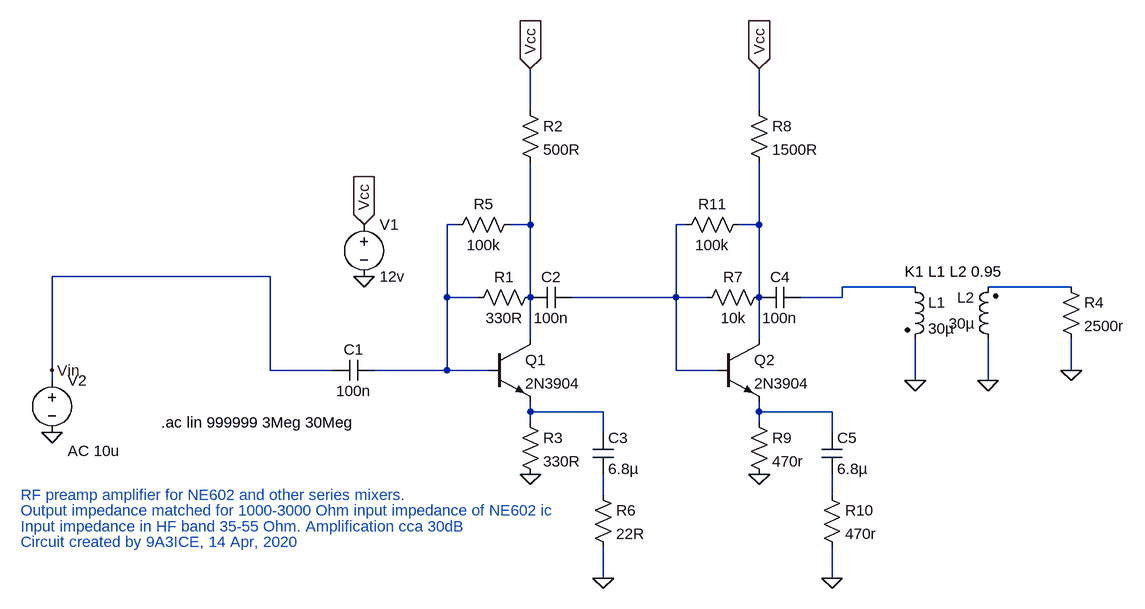
[diagram p0: schematic RF_PREAMP.asc]
RF_PREAMP.asc, the LTspice schematic file:
Version 4
SHEET 1 928 680
WIRE 0 -288 0 -352
WIRE 352 -288 352 -352
WIRE -112 -112 -128 -112
WIRE 0 -112 0 -208
WIRE 0 -112 -32 -112
WIRE 240 -112 224 -112
WIRE 352 -112 352 -208
WIRE 352 -112 320 -112
WIRE -400 -32 -736 -32
WIRE 592 -16 480 -16
WIRE 832 -16 704 -16
WIRE -128 0 -128 -112
WIRE -80 0 -128 0
WIRE 0 0 0 -112
WIRE 224 0 224 -112
WIRE 224 0 64 0
WIRE 272 0 224 0
WIRE 352 0 352 -112
WIRE 480 0 480 -16
WIRE 480 0 416 0
WIRE 0 64 0 0
WIRE 352 64 352 0
WIRE -736 112 -736 -32
WIRE -400 112 -400 -32
WIRE -304 112 -400 112
WIRE -128 112 -128 0
WIRE -128 112 -240 112
WIRE -64 112 -128 112
WIRE 224 112 224 0
WIRE 288 112 224 112
WIRE 832 112 832 64
WIRE -736 128 -736 112
WIRE 592 128 592 64
WIRE 704 128 704 64
WIRE 0 176 0 160
WIRE 112 176 0 176
WIRE 352 176 352 160
WIRE 464 176 352 176
WIRE 0 192 0 176
WIRE 352 192 352 176
WIRE 112 208 112 176
WIRE 464 208 464 176
WIRE 112 304 112 272
WIRE 464 304 464 272
WIRE 112 432 112 384
WIRE 464 432 464 384
FLAG 0 -352 Vcc
IOPIN 0 -352 In
FLAG 0 272 0
FLAG -256 -32 0
FLAG -256 -112 Vcc
IOPIN -256 -112 In
FLAG 112 432 0
FLAG -736 208 0
FLAG -736 112 Vin
FLAG 352 -352 Vcc
IOPIN 352 -352 In
FLAG 352 272 0
FLAG 464 432 0
FLAG 592 128 0
FLAG 704 128 0
FLAG 832 112 0
SYMBOL cap -240 96 R90
WINDOW 0 0 32 VBottom 2
WINDOW 3 32 32 VTop 2
SYMATTR InstName C1
SYMATTR Value 100n
SYMBOL npn -64 64 R0
SYMATTR InstName Q1
SYMATTR Value 2N3904
SYMBOL res 16 -16 R90
WINDOW 0 0 56 VBottom 2
WINDOW 3 32 56 VTop 2
SYMATTR InstName R1
SYMATTR Value 330R
SYMBOL res -16 -304 R0
SYMATTR InstName R2
SYMATTR Value 500R
SYMBOL cap 64 -16 R90
WINDOW 0 0 32 VBottom 2
WINDOW 3 32 32 VTop 2
SYMATTR InstName C2
SYMATTR Value 100n
SYMBOL res -16 176 R0
SYMATTR InstName R3
SYMATTR Value 330R
SYMBOL cap 96 208 R0
SYMATTR InstName C3
SYMATTR Value 6.8µ
SYMBOL voltage -256 -128 R0
WINDOW 123 0 0 Left 0
WINDOW 39 0 0 Left 0
SYMATTR InstName V1
SYMATTR Value 12v
SYMBOL res 96 288 R0
SYMATTR InstName R6
SYMATTR Value 22R
SYMBOL voltage -736 112 R0
WINDOW 123 24 124 Left 2
WINDOW 39 24 152 Left 2
SYMATTR Value2 AC 10u
SYMATTR InstName V2
SYMATTR Value ""
SYMBOL res -16 -128 R90
WINDOW 0 0 56 VBottom 2
WINDOW 3 32 56 VTop 2
SYMATTR InstName R5
SYMATTR Value 100k
SYMBOL npn 288 64 R0
SYMATTR InstName Q2
SYMATTR Value 2N3904
SYMBOL res 368 -16 R90
WINDOW 0 0 56 VBottom 2
WINDOW 3 32 56 VTop 2
SYMATTR InstName R7
SYMATTR Value 10k
SYMBOL res 336 -304 R0
SYMATTR InstName R8
SYMATTR Value 1500R
SYMBOL cap 416 -16 R90
WINDOW 0 0 32 VBottom 2
WINDOW 3 32 32 VTop 2
SYMATTR InstName C4
SYMATTR Value 100n
SYMBOL res 336 176 R0
SYMATTR InstName R9
SYMATTR Value 470r
SYMBOL cap 448 208 R0
SYMATTR InstName C5
SYMATTR Value 6.8µ
SYMBOL res 448 288 R0
SYMATTR InstName R10
SYMATTR Value 470r
SYMBOL res 336 -128 R90
WINDOW 0 0 56 VBottom 2
WINDOW 3 32 56 VTop 2
SYMATTR InstName R11
SYMATTR Value 100k
SYMBOL ind2 576 -32 R0
SYMATTR InstName L1
SYMATTR Value 30µ
SYMATTR Type ind
SYMBOL ind2 720 80 R180
WINDOW 0 36 80 Left 2
WINDOW 3 36 40 Left 2
SYMATTR InstName L2
SYMATTR Value 30µ
SYMATTR Type ind
SYMBOL res 816 -32 R0
SYMATTR InstName R4
SYMATTR Value 2500r
TEXT -568 192 Left 2 !.ac lin 999999 3Meg 30Meg
TEXT 576 -40 Left 2 !K1 L1 L2 0.95
TEXT -784 304 Left 2 ;RF preamp amplifier for NE602 and other series mixers.
TEXT -784 328 Left 2 ;Output impedance matched for 1000-3000 Ohm input impedance of NE602 ic
TEXT -784 352 Left 2 ;Input impedance in HF band 35-55 Ohm. Amplification cca 30dB
TEXT -784 376 Left 2 ;Circuit created by 9A3ICE, 14 Apr, 2020

The netlist it stands for:
* RF_PREAMP.asc
C1 N001 Vin 100n
Q1 N002 N001 N007 0 2N3904
R1 N002 N001 330R
R2 Vcc N002 500R
C2 N003 N002 100n
R3 N007 0 330R
C3 N007 N009 6.8µ
V1 Vcc 0 12v
R6 N009 0 22R
V2 Vin 0 AC 10u
R5 N002 N001 100k
Q2 N004 N003 N008 0 2N3904
R7 N004 N003 10k
R8 Vcc N004 1500R
C4 N005 N004 100n
R9 N008 0 470r
C5 N008 N010 6.8µ
R10 N010 0 470r
R11 N004 N003 100k
L1 N005 0 30µ
L2 0 N006 30µ
R4 N006 0 2500r
.model NPN NPN
.model PNP PNP
.lib standard.bjt
.ac lin 999999 3Meg 30Meg
K1 L1 L2 0.95
* RF preamp amplifier for NE602 and other series mixers.
* Output impedance matched for 1000-3000 Ohm input impedance of NE602 ic
* Input impedance in HF band 35-55 Ohm. Amplification cca 30dB
* Circuit created by 9A3ICE, 14 Apr, 2020
.backanno
.end